# EAGLE design main (EAGLE 6.3)
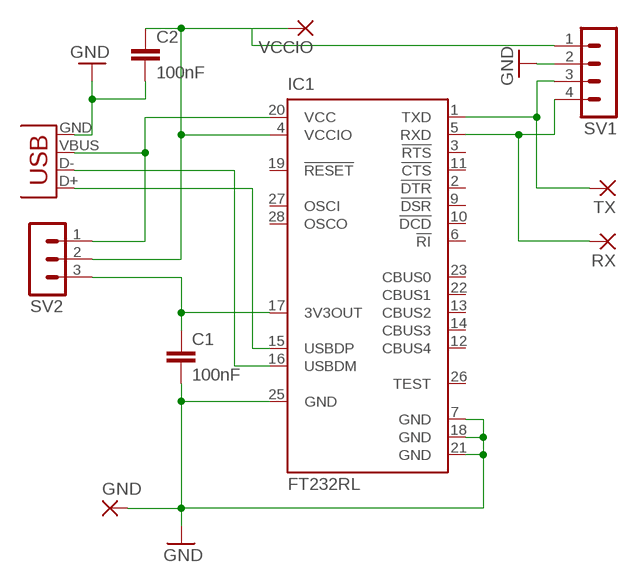
[diagram p0: schematic, sheet 1]

## Parts
C1  100nF  C-EUC0805  [C0805]
C2  100nF  C-EUC0805  [C0805]
GND  WIREPADSMD1,27-254  [SMD1,27-2,54]
IC1  FT232RL  [SSOP28]
RX  WIREPADSMD1,27-254  [SMD1,27-2,54]
SV1  MA04-1  [MA04-1]
SV2  MA03-1  [MA03-1]
TX  WIREPADSMD1,27-254  [SMD1,27-2,54]
VCCIO  WIREPADSMD1,27-254  [SMD1,27-2,54]
X1  USB-MICROB  [USB-MICROB]

## Nets
GND: C1.2 C2.2 GND.1(P) IC1.7(GND) IC1.18(GND) IC1.21(GND) IC1.25(GND) SV1.2 X1.GND
N$1: C1.1 IC1.17(3V3OUT) SV2.3
N$2: IC1.15(USBDP) X1.D+
N$3: IC1.16(USBDM) X1.D-
N$4: C2.1 IC1.4(VCCIO) SV1.1 SV2.2 VCCIO.1(P)
N$5: IC1.20(VCC) SV2.1 X1.VBUS
N$6: IC1.1(TXD) SV1.3 TX.1(P)
N$7: IC1.5(RXD) RX.1(P) SV1.4
Unconnected: IC1.2(!DTR) IC1.3(!RTS) IC1.6(!RI) IC1.9(!DSR) IC1.10(!DCD) IC1.11(!CTS) IC1.12(CBUS4) IC1.13(CBUS2) IC1.14(CBUS3) IC1.19(!RESET) IC1.22(CBUS1) IC1.23(CBUS0) IC1.26(TEST) IC1.27(OSCI) IC1.28(OSCO)

## Library data of the parts
C1 C2 = rcl:C-EU: CAPACITOR, European symbol
GND RX TX VCCIO = wirepad:WIREPAD: Wire PAD connect wire on PCB
IC1 = ftdichip:FT232R: Source: http://www.ftdichip.com/Documents/DataSheets/DS_FT232R_v104.pdf; MPN: FT232RL; OC_FARNELL: 1146032; OC_NEWARK: 91K9918
SV1 = con-lstb:MA04-1: PIN HEADER; OC_FARNELL: unknown; OC_NEWARK: unknown
SV2 = con-lstb:MA03-1: PIN HEADER; OC_FARNELL: unknown; OC_NEWARK: unknown
X1 = SparkFun:USB: USB Connectors USB-B-PTH is fully proven SKU : PRT-00139 USB-miniB is fully proven SKU : PRT-00587 USB-A-PCB is untested. USB-A-H is throughly reviewed, but untested. Spark Fun Electronics SKU : PRT-00437 USB-B-SMT is throughly reviewed, but untested. Needs silkscreen touching up. USB-A-S has not been used/tested USB-MB-H has not been used/tested

## Board
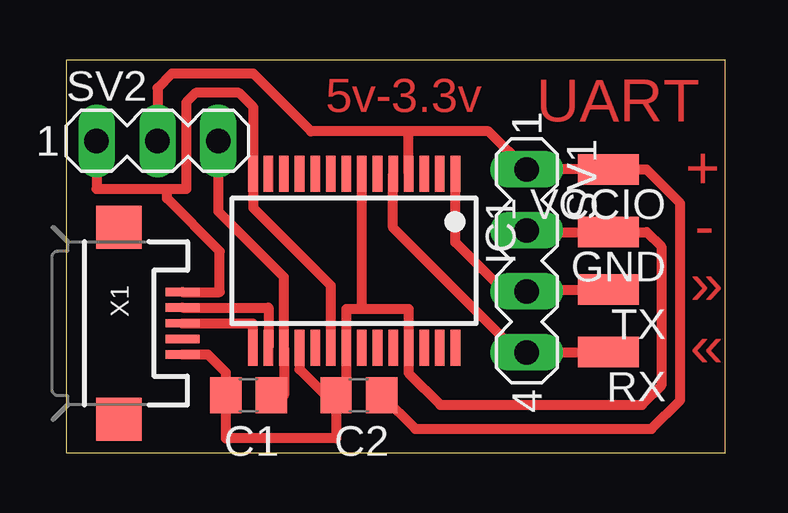
[diagram p1: board, top side]

Size 27.48 x 16.37 mm. Coordinates in mm from the lower left corner, seen from the top.
Outline: 0,0 27.48,0 27.48,16.37 0,16.37 0,0
Copper layers (1*16): Top 0.035mm / dielectric 1.5mm / Bottom 0.035mm
Design rules "default": minimum track width 10mil, minimum drill 24mil, track to track 8mil, track to pad 8mil, pad to pad 8mil, via to via 8mil, smd to smd 8mil, copper to edge 40mil, drill to drill 8mil, minimum pad ring 10mil, minimum via ring 8mil, stop-mask expansion 4mil, vias tented up to drill 0mil, thermal gap 10mil

### Footprints (pad centres in the part's own frame; a part is rotated, then mirrored left to right if it is on the bottom)
C0805 = smd 1.3 x 1.5: 1 -0.95,0; 2 0.95,0
SMD1,27-2,54 = smd 1.27 x 2.54: 1 0,0
SSOP28 = smd 0.4 x 1.5: 1 -4.225,-3.625; 2 -3.575,-3.625; 3 -2.925,-3.625; 4 -2.275,-3.625; 5 -1.625,-3.625; 6 -0.975,-3.625; 7 -0.325,-3.625; 8 0.325,-3.625; 9 0.975,-3.625; 10 1.625,-3.625; 11 2.275,-3.625; 12 2.925,-3.625; 13 3.575,-3.625; 14 4.225,-3.625; 15 4.225,3.625; 16 3.575,3.625; 17 2.925,3.625; 18 2.275,3.625; 19 1.625,3.625; 20 0.975,3.625; 21 0.325,3.625; 22 -0.325,3.625; 23 -0.975,3.625; 24 -1.625,3.625; 25 -2.275,3.625; 26 -2.925,3.625; 27 -3.575,3.625; 28 -4.225,3.625
MA04-1 = drill 1.016 long: 1 -3.81,0; 2 -1.27,0; 3 1.27,0; 4 3.81,0
MA03-1 = drill 1.016 long: 1 -2.54,0; 2 0,0; 3 2.54,0
USB-MICROB = smd 0.35 x 1.4: D+ 0,2.65; D- -0.65,2.65; GND 1.3,2.65; ID 0.65,2.65; VBUS -1.3,2.65 | smd 1.8 x 1.9: MT1 -4,0; MT2 4,0

### Placement (x,y rotation side)
C1  7.6,2.4 180 top
C2  12.2,2.4 180 top
GND  22.6,9.2 90 top
IC1  12,8 180 top
RX  22.6,4.2 90 top
SV1  19.2,8 270 top
SV2  3.8,13 0 top
TX  22.6,6.8 90 top
VCCIO  22.6,11.8 90 top
X1  2.2,5.4 270 top

### Tracks (layer width: path | path; a pad name or v marks a point on that pad's centre or on a via)
GND
  Top 0.406: 11.68,2.4 C2.2 | IC1.18 9.72,3.48 10.8,2.4 C2.2 | C2.2 11.25,2.6 11.68,3.02 IC1.21 11.68,6 12.32,6 | X1.GND 5.9,4.1 6.65,3.35 C1.2 6.65,0.6 11.25,0.6 C2.2 | 12.32,6 14.28,6 IC1.25 14.28,3.33 15.6,2 24,2 24.8,2.8 24.8,8.6 24.2,9.2 GND.1 19.27,9.2 SV1.2 | 12.32,6 IC1.7
N$1
  Top 0.406: C1.1 9.07,2.4 IC1.17 9.07,7.33 6.34,10.06 SV2.3
N$2
  Top 0.406: X1.D+ 7.78,5.4 IC1.15
N$3
  Top 0.406: X1.D- 8.43,6.05 IC1.16
N$4
  Top 0.406: C2.1 14.55,1 24.4,1 25.6,2.2 25.6,10.4 24.2,11.8 VCCIO.1 SV1.1 17.61,13.4 14.4,13.4 | 14.4,13.4 10.2,13.4 7.8,15.8 4.4,15.8 3.8,15.2 SV2.2 | IC1.4 14.28,13.28 14.4,13.4
N$5
  Top 0.406: X1.VBUS 6.4,6.7 6.4,8.4 4.2,10.6 4.2,11 | IC1.20 11.03,6.97 7.8,10.2 7.8,14.4 7.2,15 5.4,15 5,14.6 5,11 4.2,11 | SV2.1 1.26,11 4.2,11
N$6
  Top 0.406: SV1.3 19.27,6.8 | 19.27,6.8 TX.1 | 19.27,6.8 18.2,6.8 16.23,8.78 IC1.1
N$7
  Top 0.406: IC1.5 13.62,9.38 18.81,4.19 SV1.4 RX.1

### Text on the board
Top: 5v-3.3v | UART | + | - | » | «